# Altium schematic sheet 海关全向控制器主控板电路V2_USB电路.SchDoc
size A4
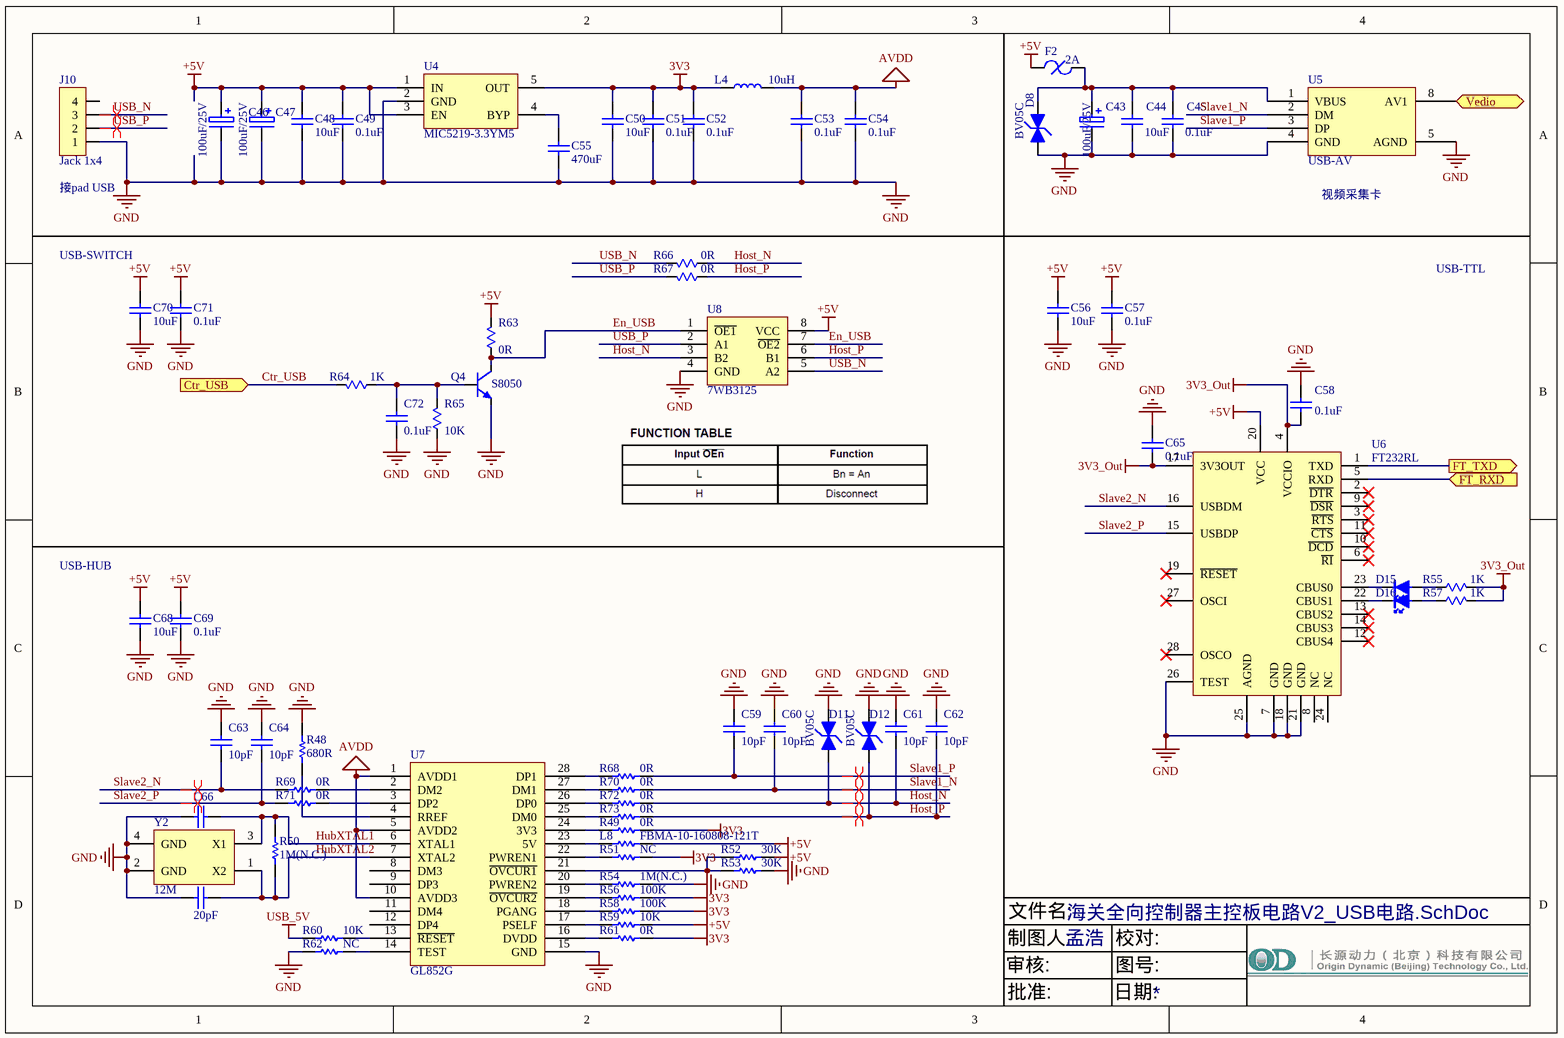
[diagram p0: 海关全向控制器主控板电路V2_USB电路.SchDoc]

## Parts
C43  100uF/25V  [C7343]
C44  10uF  [C0603]
C45  0.1uF  [C0603]
C46  100uF/25V  [C7343]
C47  100uF/25V  [C7343]
C48  10uF  [C0603]
C49  0.1uF  [C0603]
C50  10uF  [C0603]
C51  0.1uF  [C0603]
C52  0.1uF  [C0603]
C53  0.1uF  [C0603]
C54  0.1uF  [C0603]
C55  470uF  [C0603]
C56  10uF  [C0603]
C57  0.1uF  [C0603]
C58  0.1uF  [C0603]
C59  10pF  [C0603]
C60  10pF  [C0603]
C61  10pF  [C0603]
C62  10pF  [C0603]
C63  10pF  [C0603]
C64  10pF  [C0603]
C65  0.1uF  [C0603]
C66  20pF  [C0603]
C67  20pF  [C0603]
C68  10uF  [C0603]
C69  0.1uF  [C0603]
C70  10uF  [C0603]
C71  0.1uF  [C0603]
C72  0.1uF  [C0603]
D8  BV05C  [SOD323]
D11  BV05C  [SOD323]
D12  BV05C  [SOD323]
D15  LED  [LED0603]  (value not drawn)
D16  LED  [LED0603]  (value not drawn)
F2  2A  [F1218]
J10  Jack 1x4  [ZH-4AWD]
L4  10uH  [L0603]
L8  FBMA-10-160808-121T  [R0603]
Q4  S8050  [SOT-23]
R48  680R  [R0603]
R49  0R  [R0603]
R50  1M(N.C.)  [R0603]
R51  NC  [R0603]
R52  30K  [R0603]
R53  30K  [R0603]
R54  1M(N.C.)  [R0603]
R55  1K  [R0603]
R56  100K  [R0603]
R57  1K  [R0603]
R58  100K  [R0603]
R59  10K  [R0603]
R60  10K  [R0603]
R61  0R  [R0603]
R62  NC  [R0603]
R63  0R  [R0603]
R64  1K  [R0603]
R65  10K  [R0603]
R66  0R  [R0603]
R67  0R  [R0603]
R68  0R  [R0603]
R69  0R  [R0603]
R70  0R  [R0603]
R71  0R  [R0603]
R72  0R  [R0603]
R73  0R  [R0603]
U4  MIC5219-3.3YM5  [SOT-23-5]
U5  USB-AV  [USB-AV]
U6  FT232RL  [SSOP-28]
U7  GL852G  [SSOP-28]
U8  7WB3125  [Micro8]
Y2  12M  [XTAL3225]

## Ports
Ctr_USB (in), FT_RXD (in), FT_TXD (out), Vedio (in)

## Nets
3V3: C50.1 C51.2 C52.2 L4.1 R49.1 R51.1 R56.1 R58.1 R61.1 U4.5(OUT)
3V3_Out: C58.2 C65.1 R55.1 R57.1 U6.4(VCCIO) U6.17(3V3OUT)
+5V: C46.1 C47.1 C48.1 C49.2 C56.1 C57.2 C68.1 C69.2 C70.1 C71.2 F2.1 L8.2 R52.1 R59.1 R63.1 U4.1(IN) U4.3(EN) U6.20(VCC) U8.8(VCC)
AVDD: C53.2 C54.2 L4.2 U7.1(AVDD1) U7.5(AVDD2) U7.10(AVDD3)
GND: C43.2 C44.2 C45.1 C46.2 C47.2 C48.2 C49.1 C50.2 C51.1 C52.1 C53.1 C54.1 C55.1 C56.2 C57.1 C58.1 C59.2 C60.2 C61.2 C62.2 C63.2 C64.2 C65.2 C66.2 C67.2 C68.2 C69.1 C70.2 C71.1 C72.1 D8.2(K) D11.1(A) D12.1(A) J10.1 Q4.2(E) R48.2 R53.1 R54.1 R62.2 R65.2 U4.2(GND) U5.4(GND) U5.5(AGND) U6.7(GND) U6.18(GND) U6.21(GND) U6.25(AGND) U6.26(TEST) U7.15(GND) U8.4(GND) Y2.2(GND) Y2.4(GND)
USB_5V: R60.2
Ctr_USB: R64.1 ; port Ctr_USB
En_USB: Q4.3(C) R63.2 U8.1(~{OE1}) U8.7(~{OE2})
FT_RXD: U6.5(RXD) ; port FT_RXD
FT_TXD: U6.1(TXD) ; port FT_TXD
Host_N: C61.1 D11.2(K) R66.2 R72.1 U8.3(B2)
Host_P: C62.1 D12.2(K) R67.2 R73.1 U8.6(B1)
HubXTAL1: C66.1 R50.2 U7.6(XTAL1) Y2.3(X1)
HubXTAL2: C67.1 R50.1 U7.7(XTAL2) Y2.1(X2)
Slave1_N: C60.1 R70.1 U5.2(DM)
Slave1_P: C59.1 R68.1 U5.3(DP)
Slave2_N: C63.1 R69.2 U6.16(USBDM)
Slave2_P: C64.1 R71.2 U6.15(USBDP)
USB_N: J10.3 R66.1 U8.5(A2)
USB_P: J10.2 R67.1 U8.2(A1)
Vedio: U5.8(AV1) ; port Vedio
NetC43_1: C43.1 C44.1 C45.2 D8.1(A) F2.2 U5.1(VBUS)
NetC55_2: C55.2 U4.4(BYP)
NetC72_2: C72.2 Q4.1(B) R64.2 R65.1
NetD15_1: D15.1(A) R55.2
NetD15_2: D15.2(K) U6.23(CBUS0)
NetD16_1: D16.1(A) R57.2
NetD16_2: D16.2(K) U6.22(CBUS1)
NetL8_1: L8.1 U7.23(5V)
NetR48_1: R48.1 U7.4(RREF)
NetR49_2: R49.2 U7.24(3V3)
NetR51_2: R51.2 U7.22(PWREN1)
NetR52_2: R52.2 R53.2 U7.21(~{OVCUR1})
NetR54_2: R54.2 U7.20(PWREN2)
NetR56_2: R56.2 U7.19(~{OVCUR2})
NetR58_2: R58.2 U7.18(PGANG)
NetR59_2: R59.2 U7.17(PSELF)
NetR60_1: R60.1 U7.13(~{RESET})
NetR61_2: R61.2 U7.16(DVDD)
NetR62_1: R62.1 U7.14(TEST)
NetR68_2: R68.2 U7.28(DP1)
NetR69_1: R69.1 U7.2(DM2)
NetR70_2: R70.2 U7.27(DM1)
NetR71_1: R71.1 U7.3(DP2)
NetR72_2: R72.2 U7.26(DP0)
NetR73_2: R73.2 U7.25(DM0)

Not connected (* = marked no-connect by the designer): J10 4; U6 2(~{DTR})* 3(~{RTS})* 6(~{RI})* 8(NC) 9(~{DSR})* 10(~{DCD})* 11(~{CTS})* 12(CBUS4)* 13(CBUS2)* 14(CBUS3)* 19(~{RESET})* 24(NC) 27(OSCI)* 28(OSCO)*; U7 8(DM3) 9(DP3) 11(DM4) 12(DP4)

## Layout directives
differential pair: Host_N, Host_P, Slave1_N, Slave1_P, Slave2_N, Slave2_P, USB_N, USB_P

## Notes on the sheet
- (near J10) 接pad USB
- (near U5) 视频采集卡
- (near C70) USB-SWITCH
- USB-TTL
- USB-HUB
- 文件名:
- 审核:
- 制图人:
- 孟浩
- 校对:
- 图号:
- 批准:
- 日期:

## Library data of the parts
C43 C46 C47 = Cap Poll
C44 C48 C50 C56 C68 C70 C72 = CAP: Published: 8-Jun-2000; LatestRevisionDate: 17-Jul-2002; LatestRevisionNote: Re-released for DXP Platform.; PackageReference: RAD-0.3; Publisher: Altium Limited
  C44 C48 C50 C56 C68 C70: Value: 10uF
  C72: Value: 0.1uF
C45 C49 C51-C55 C57 C59-C67 C69 C71 = Cap Semi
C58 = Cap: Capacitor; Value: 22pF; Published: 8-Jun-2000; Revision: July-2002: Re-released for DXP Platform.; Publisher: Altium Limited
D8 D11 D12 = Diode-TVS
F2 = Fuse2
J10 = Jack 1x4: 插座
L4 = Inductor
L8 R48-R54 R56 R58-R62 R68-R73 = Res
Q4 = NPN: NPN General Purpose Amplifier; Published: 8-Jun-2000; LatestRevisionDate: 15-Jan-2003; LatestRevisionNote: PCB Footprint 'BCY-W3/D4.7' replaced; DatasheetDocument: 1997; PackageDocument: Sep-1998; PackageReference: TO-92A; Publisher: Altium Limited; Code_JEDEC: TO-92A; ComponentLink1Description: Manufacturer Link; ComponentLink1URL: http://www.fairchildsemi.com/; ComponentLink2Description: Datasheet; ComponentLink2URL: http://www.fairchildsemi.com/ds/2N%2F2N3904.pdf
R55 R57 R63-R67 = Res: Resistor; Published: 8-Jun-2000; LatestRevisionDate: 04-Mar-2005; LatestRevisionNote: PCB Footprint replaced.; PackageReference: J1-0603; Publisher: Altium Limited
  R55 R57: Value: 1K
  R63 R66 R67: Value: 0R
  R65: Value: 10K
U4 = MIC5205
U7 = GL850G: USB 2.0 Low-Power HUB Controller
Y2 = XTAL3225